# EAGLE schematic circuit (EAGLE 9.4.2)
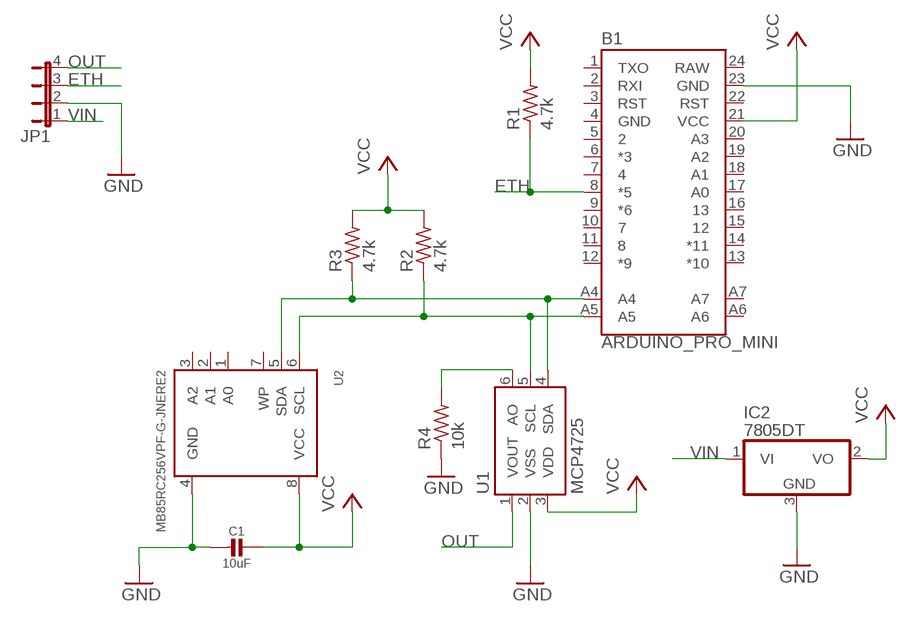
[diagram p0: schematic, sheet 1]

## Parts
B1  ARDUINO_PRO_MINI  [ARDUINO_PRO_MINI]
C1  10uF  CAP_CERAMIC_0805MP  [_0805MP]
IC2  7805DT  [TO252]
JP1  JP4E  [JP4]
R1  4.7k  R-US_M1206  [M1206]
R2  4.7k  R-US_M1206  [M1206]
R3  4.7k  R-US_M1206  [M1206]
R4  10k  R-US_M1206  [M1206]
U1  MCP4725  MCP4725SOT-23  [SOT23-6]
U2  MB85RC256VPF-G-JNERE2  FRAM_SOIC8_I2C  [SOIC8_208MIL]

## Nets
ETH: B1.8(*5) JP1.3 R1.1
GND: B1.23(GND) C1.2 IC2.3(GND) JP1.2 R4.1 U1.2(VSS) U2.4(GND)
N$1: B1.A5 R2.1 U1.5(SCL) U2.6(SCL)
N$2: B1.A4 R3.1 U1.4(SDA) U2.5(SDA)
N$4: R4.2 U1.6(AO)
OUT: JP1.4 U1.1(VOUT)
VCC: B1.21(VCC) C1.1 IC2.2(VO) R1.2 R2.2 R3.2 U1.3(VDD) U2.8(VCC)
VIN: IC2.1(VI) JP1.1
Unconnected: B1.1(TXO) B1.2(RXI) B1.3(RST) B1.5 B1.6(*3) B1.7 B1.9(*6) B1.10 B1.11 B1.12(*9) B1.13(*10) B1.14(*11) B1.15 B1.16 B1.17(A0) B1.18(A1) B1.19(A2) B1.20(A3) B1.22(RST) B1.A6 B1.A7 U2.1(A0) U2.2(A1) U2.3(A2) U2.7(WP)

## Power pins joined to a net without a drawn wire
GND: B1.4(GND)
RAW: B1.24(RAW)

## Library data of the parts
B1 = SparkFun-Boards:ARDUINO_PRO_MINI: SparkFun Pro Mini Pro Mini compatible footprint. Dimensions: 0.7 x 1.3" PCB Thickness: 0.8mm SparkFun Products: 3.3V/8MHz <https://www.sparkfun.com/products/11114> 5V/16MHz <https://www.sparkfun.com/products/11113>
C1 = microbuilder:CAP_CERAMIC: Ceramic Capacitors For new designs, use the packages preceded by an '_' character since they are more reliable: The following footprints should be used on most boards: _0402 - Standard footprint for regular board layouts _0603 - Standard footprint for regular board layouts _0805 - Standard footprint for regular board layouts _1206 - Standard footprint for regular board layouts For extremely tight-pitch boards where space is at a premium, the following 'micro-pitch' footprints can be used (smaller pads, no silkscreen outline, etc.): _0402MP - Micro-pitch footprint for very dense/compact boards _0603MP - Micro-pitch footprint for very dense/compact boards _0805MP - Micro-pitch footprint for very dense/compact boards _1206MP - Micro-pitch footprint for very dense/compact boards
IC2 = adafruit:78*: Positive VOLTAGE REGULATOR Added bigger pads to the TO-92 package
JP1 = jumper:JP4E: JUMPER
R1-R4 = adafruit:R-US_: RESISTOR, American symbol
U1 = SparkFun-IC-Conversion:MCP4725: MCP4725 DAC Microchip 12-bit I2C DAC, SOT23-6 Datasheet <https://cdn.sparkfun.com/datasheets/BreakoutBoards/MCP4725_2009.pdf> SparkFun Products SparkFun I2C DAC Breakout - MCP4725 <https://www.sparkfun.com/products/12918> (BOB-12918); PROD_ID: IC-08886
U2 = microbuilder:FRAM_SOIC8_I2C: I2C FRAM - SOIC8 Package 256KBit (32Kx8) - MB85RC256VPF-G-JNERE2 - SOIC-8 200 Mil, 2.7-5.5V, -40°C-85°C